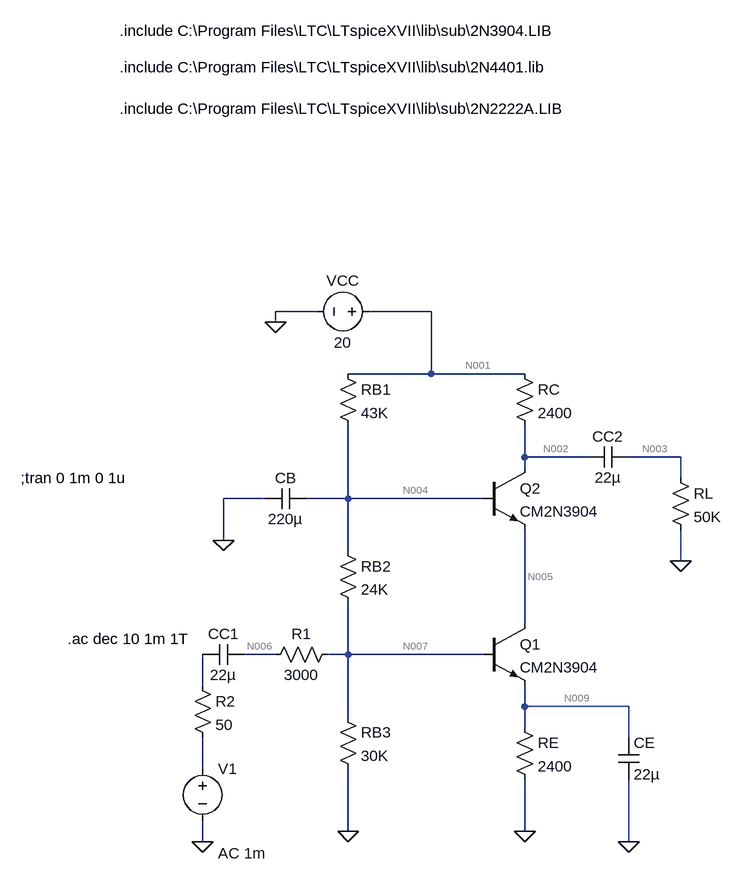
[diagram p0: schematic Cascode new values bode plot.asc]
Cascode new values bode plot.asc, the LTspice schematic file:
Version 4
SHEET 1 1036 996
WIRE -32 112 -96 112
WIRE 144 112 48 112
WIRE -96 128 -96 112
WIRE 144 208 144 112
WIRE 144 208 16 208
WIRE 288 208 144 208
WIRE 288 336 288 288
WIRE 384 336 288 336
WIRE 528 336 448 336
WIRE 288 352 288 336
WIRE 528 368 528 336
WIRE -112 400 -176 400
WIRE 16 400 16 288
WIRE 16 400 -48 400
WIRE 224 400 16 400
WIRE -176 464 -176 400
WIRE 16 480 16 400
WIRE 528 496 528 448
WIRE 288 592 288 448
WIRE -96 640 -144 640
WIRE 16 640 16 560
WIRE 16 640 -16 640
WIRE 224 640 16 640
WIRE -208 688 -208 640
WIRE 288 720 288 688
WIRE 448 720 288 720
WIRE 16 736 16 640
WIRE 288 752 288 720
WIRE 448 768 448 720
WIRE -208 816 -208 768
WIRE 16 912 16 816
WIRE 288 912 288 832
WIRE -208 928 -208 896
WIRE 448 928 448 832
FLAG -96 128 0
FLAG 288 912 0
FLAG 16 912 0
FLAG -176 464 0
FLAG 448 928 0
FLAG -208 928 0
FLAG 528 496 0
SYMBOL npn 224 592 R0
SYMATTR InstName Q1
SYMATTR Value CM2N3904
SYMBOL npn 224 352 R0
SYMATTR InstName Q2
SYMATTR Value CM2N3904
SYMBOL res 272 192 R0
SYMATTR InstName RC
SYMATTR Value 2400
SYMBOL res 0 192 R0
SYMATTR InstName RB1
SYMATTR Value 43K
SYMBOL voltage 64 112 R90
WINDOW 0 -32 56 VBottom 2
WINDOW 3 32 56 VTop 2
WINDOW 123 0 0 Left 0
WINDOW 39 0 0 Left 0
SYMATTR InstName VCC
SYMATTR Value 20
SYMBOL res 0 464 R0
SYMATTR InstName RB2
SYMATTR Value 24K
SYMBOL res 272 736 R0
SYMATTR InstName RE
SYMATTR Value 2400
SYMBOL res 0 720 R0
SYMATTR InstName RB3
SYMATTR Value 30K
SYMBOL cap -144 624 R90
WINDOW 0 0 32 VBottom 2
WINDOW 3 32 32 VTop 2
SYMATTR InstName CC1
SYMATTR Value 22µ
SYMBOL cap -48 384 R90
WINDOW 0 0 32 VBottom 2
WINDOW 3 32 32 VTop 2
SYMATTR InstName CB
SYMATTR Value 220µ
SYMBOL cap 432 768 R0
SYMATTR InstName CE
SYMATTR Value 22µ
SYMBOL cap 448 320 R90
WINDOW 0 0 32 VBottom 2
WINDOW 3 32 32 VTop 2
SYMATTR InstName CC2
SYMATTR Value 22µ
SYMBOL res 512 352 R0
SYMATTR InstName RL
SYMATTR Value 50K
SYMBOL res 0 624 R90
WINDOW 0 0 56 VBottom 2
WINDOW 3 32 56 VTop 2
SYMATTR InstName R1
SYMATTR Value 3000
SYMBOL res -224 672 R0
SYMATTR InstName R2
SYMATTR Value 50
SYMBOL voltage -208 800 R0
WINDOW 123 24 146 Left 2
WINDOW 39 0 0 Left 0
SYMATTR Value2 AC 1m
SYMATTR InstName V1
SYMATTR Value ""
TEXT -336 -200 Left 2 !.include C:\\Program Files\\LTC\\LTspiceXVII\\lib\\sub\\2N2222A.LIB
TEXT -336 -264 Left 2 !.include C:\\Program Files\\LTC\\LTspiceXVII\\lib\\sub\\2N4401.lib
TEXT -336 -320 Left 2 !.include C:\\Program Files\\LTC\\LTspiceXVII\\lib\\sub\\2N3904.LIB
TEXT -488 368 Left 2 !;tran 0 1m 0 1u
TEXT -416 616 Left 2 !.ac dec 10 1m 1T

The netlist it stands for:
* Cascode new values bode plot.asc
Q1 N005 N007 N009 0 CM2N3904
Q2 N002 N004 N005 0 CM2N3904
RC N001 N002 2400
RB1 N001 N004 43K
VCC N001 0 20
RB2 N004 N007 24K
RE N009 0 2400
RB3 N007 0 30K
CC1 N006 N008 22µ
CB N004 0 220µ
CE N009 0 22µ
CC2 N003 N002 22µ
RL N003 0 50K
R1 N007 N006 3000
R2 N008 N010 50
V1 N010 0 AC 1m
.model NPN NPN
.model PNP PNP
.lib standard.bjt
.include C:\Program Files\LTC\LTspiceXVII\lib\sub\2N2222A.LIB
.include C:\Program Files\LTC\LTspiceXVII\lib\sub\2N4401.lib
.include C:\Program Files\LTC\LTspiceXVII\lib\sub\2N3904.LIB
;tran 0 1m 0 1u
.ac dec 10 1m 1T
.backanno
.end

* Results of the author's LTspice run, read from the files saved beside the schematic
* Operating Point, zero values left out:
*   V(n005) = 9.888 V
*   V(n007) = 5.654 V
*   V(n009) = 4.988 V
*   V(n002) = 15.09 V
*   V(n004) = 10.55 V
*   V(n001) = 20 V
*   V(n006) = 5.654 V
*   Ic(Q2) = 2.047 mA
*   Ib(Q2) = 15.54 µA
*   Ie(Q2) = -2.063 mA
*   Ic(Q1) = 2.063 mA
*   Ib(Q1) = 15.68 µA
*   Ie(Q1) = -2.078 mA
*   I(Rb3) = 188.5 µA
*   I(Re) = 2.078 mA
*   I(Rb2) = 204.1 µA
*   I(Rb1) = 219.7 µA
*   I(Rc) = 2.047 mA
*   I(Vcc) = -2.267 mA
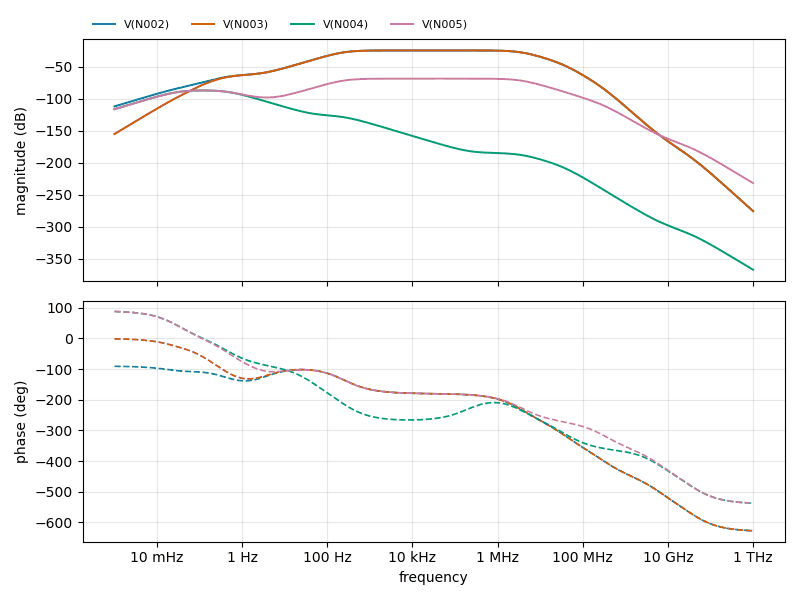
[diagram p1: AC Analysis of Cascode new values bode plot.asc, plotted from the saved traces]
* AC Analysis, 1 run:
*   V(N002): -111.84 dB at 1 mHz, -275.72 dB at 1 THz, peak -24.21 dB at 31.62 kHz, 3 dB below the peak at 247 Hz and 3.438 MHz
*   V(N003): -155.04 dB at 1 mHz, -275.72 dB at 1 THz, peak -24.21 dB at 31.62 kHz, 3 dB below the peak at 247 Hz and 3.438 MHz
*   V(N004): -116.15 dB at 1 mHz, -367.39 dB at 1 THz, peak -86.86 dB at 125.9 mHz, 3 dB below the peak at 27.76 mHz and 523.7 mHz
*   V(N005): -116.24 dB at 1 mHz, -231.82 dB at 1 THz, peak -68.38 dB at 31.62 kHz, 3 dB below the peak at 246.9 Hz and 3.464 MHz